# Altium schematic sheet 2019_TFT_Strateasy.SchDoc
size A4
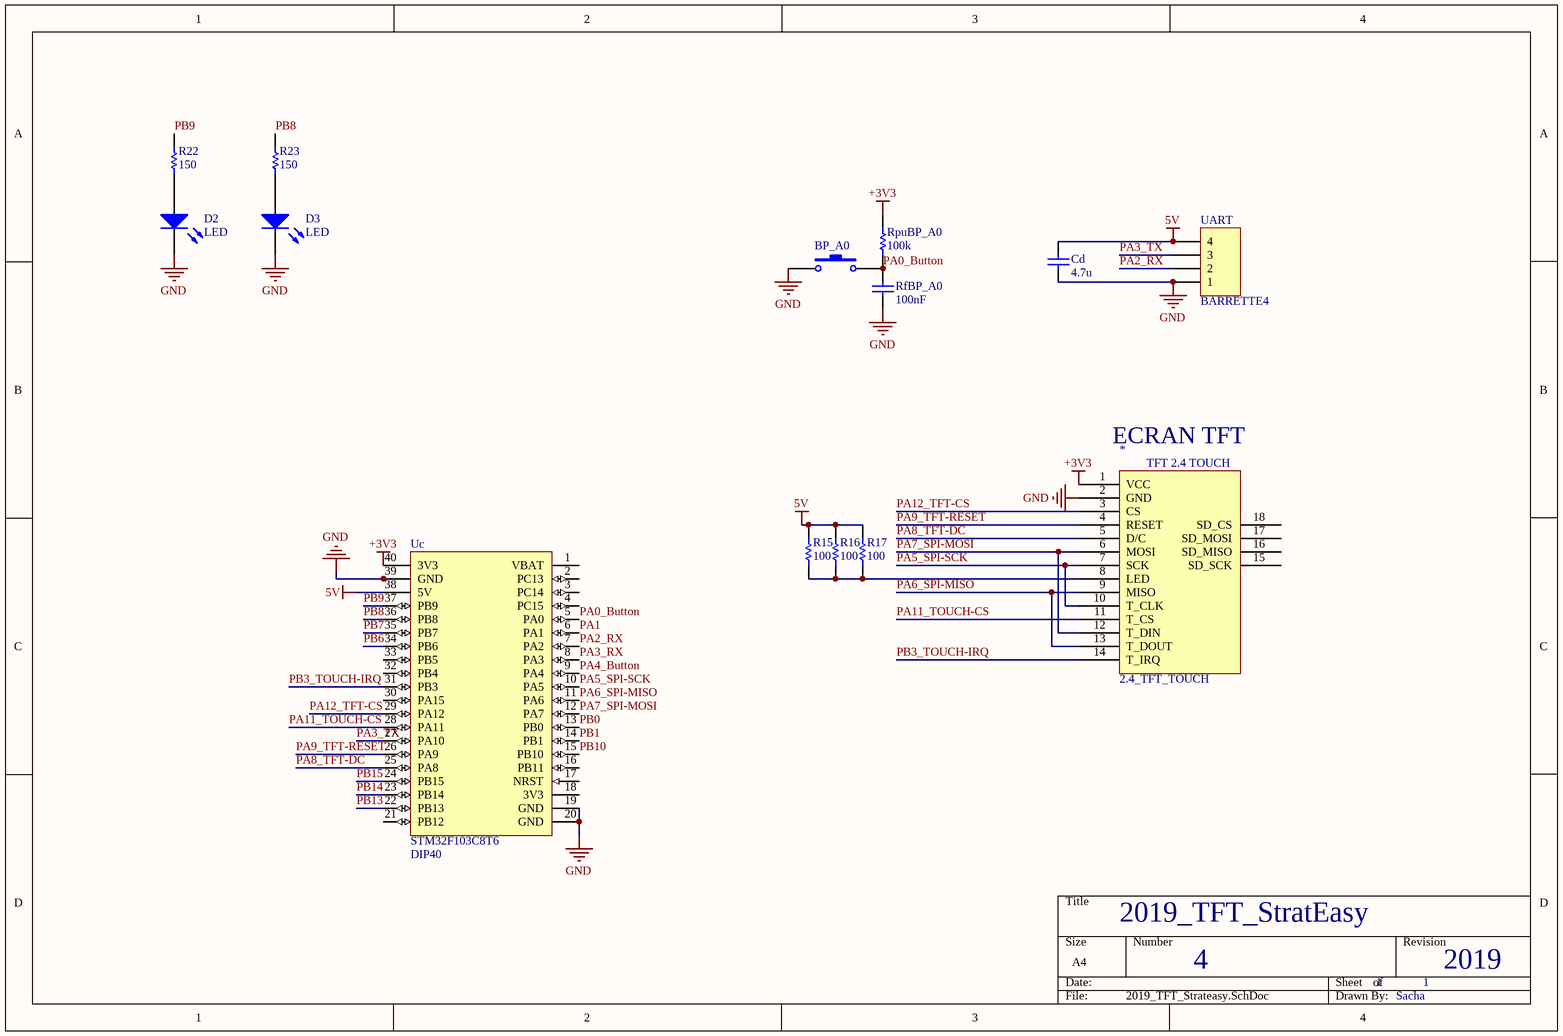
[diagram p0: 2019_TFT_Strateasy.SchDoc]

## Parts
*  2.4_TFT_TOUCH  [2.4_TFT_TOUCH]
BP_A0  SW_Pushbutton_6x6mm_Vertical  [Switch 6x6 Vertical]  (value not drawn)
Cd  4.7u  [C0805_N]
D2  LED  [LED_0805]
D3  LED  [LED_0805]
R15  100  [R1206_N]
R16  100  [R1206_N]
R17  100  [R1206_N]
R22  150  [R1206_N]
R23  150  [R1206_N]
RfBP_A0  100nF  [C0805_N]
RpuBP_A0  100k  [R1206_N]
UART  BARRETTE4  [HE14_4]
Uc  Type: STM32F103C8T6  Package: DIP40  [STM32F103C8T6_DIP40]  (hidden comment: STM32F103C8T6/PCB_DIP40)

## Nets
5V: Cd.2 R15.2 R16.2 R17.2 UART.4 Uc.38(5V)
+3V3: *.1(VCC) RpuBP_A0.1 Uc.40(3V3)
GND: *.2(GND) BP_A0.1 Cd.1 D2.2(K) D3.2(K) RfBP_A0.1 UART.1 Uc.19(GND) Uc.20(GND) Uc.39(GND)
PA0_Button: BP_A0.3 RfBP_A0.2 RpuBP_A0.2 Uc.5(PA0)
PA1: Uc.6(PA1)
PA2_RX: UART.2 Uc.7(PA2)
PA3_RX: Uc.8(PA3)
PA3_TX: UART.3 Uc.27(PA10)
PA4_Button: Uc.9(PA4)
PA5_SPI-SCK: *.7(SCK) *.10(T_CLK) Uc.10(PA5)
PA6_SPI-MISO: *.9(MISO) *.13(T_DOUT) Uc.11(PA6)
PA7_SPI-MOSI: *.6(MOSI) *.12(T_DIN) Uc.12(PA7)
PA8_TFT-DC: *.5(D/C) Uc.25(PA8)
PA9_TFT-RESET: *.4(RESET) Uc.26(PA9)
PA11_TOUCH-CS: *.11(T_CS) Uc.28(PA11)
PA12_TFT-CS: *.3(CS) Uc.29(PA12)
PB0: Uc.13(PB0)
PB1: Uc.14(PB1)
PB3_TOUCH-IRQ: *.14(T_IRQ) Uc.31(PB3)
PB6: Uc.34(PB6)
PB7: Uc.35(PB7)
PB8: R23.2 Uc.36(PB8)
PB9: R22.2 Uc.37(PB9)
PB10: Uc.15(PB10)
PB13: Uc.22(PB13)
PB14: Uc.23(PB14)
PB15: Uc.24(PB15)
Net*_8: *.8(LED) R15.1 R16.1 R17.1
NetD2_1: D2.1(A) R22.1
NetD3_1: D3.1(A) R23.1

Not connected (* = marked no-connect by the designer): * 15(SD_SCK) 16(SD_MISO) 17(SD_MOSI) 18(SD_CS); Uc 1(VBAT) 2(PC13) 3(PC14) 4(PC15) 16(PB11) 17(NRST) 18(3V3) 21(PB12) 30(PA15) 32(PB4) 33(PB5)

## Notes on the sheet
- (near *) ECRAN TFT
- 2019_TFT_StratEasy
- 4
- 1
- 2019
- Sacha
- (in symbol 2.4_TFT_TOUCH) TFT 2.4 TOUCH

## Library data of the parts
BP_A0 = SW_Pushbutton_6x6mm_Vertical: Switch tactil 6mm x 6mm Vertical; Published: 27/11/09; PackageReference: 6mm X 6mm; Publisher: Damien Guitton
Cd RfBP_A0 = Condensateur: Capacitor; Published: 8-Jun-2000; LatestRevisionDate: 17-Jul-2002; LatestRevisionNote: Re-released for DXP Platform.; PackageReference: RAD-0.3; Publisher: Altium Limited
D2 D3 = LED: Typical LED; Published: 8-Jun-2000; LatestRevisionDate: 08-Jul-2005; LatestRevisionNote: Mech Layer 1 removed.; PackageReference: LED-1; Publisher: Altium Limited
R15-R17 R22 R23 RpuBP_A0 = Resistor: Published: 8-Jun-2000; LatestRevisionDate: 17-Jul-2002; LatestRevisionNote: Re-released for DXP Platform.; PackageReference: AXIAL-0.5; Publisher: Altium Limited
UART = BARRETTE4: Header, 4-Pin; LatestRevisionDate: 17-Jul-2002; LatestRevisionNote: Re-released for DXP Platform.; Publisher: Altium Limited
Uc = STM32F103C8T6/PCB_DIP40: MICROCONTROLEUR 32 BITS - 72MHz - 34 I/O - 64 KO : FLASH - 20KO RAM - 10 CANAUX A/D 12 BITS - DIP40 - UART, SPI, I2C, USB, CAN